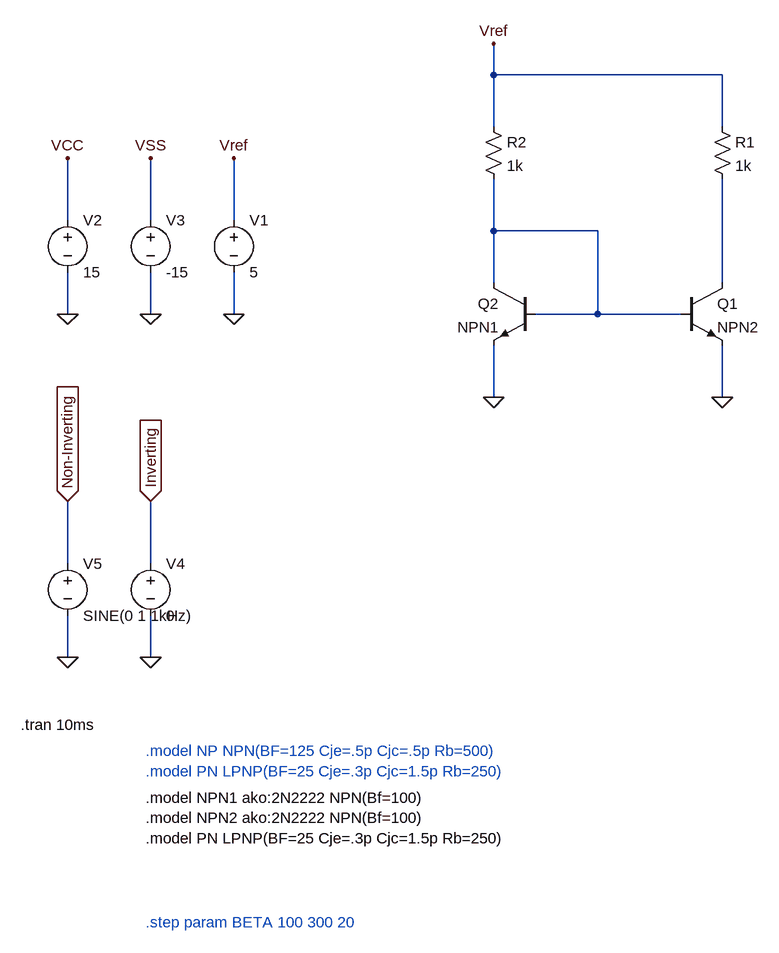
[diagram p0: schematic m_Opamp_VLSI_BJT_CST.asc]
m_Opamp_VLSI_BJT_CST.asc, the LTspice schematic file:
Version 4
SHEET 1 880 888
WIRE -1744 -432 -1744 -480
WIRE -1392 -432 -1744 -432
WIRE -1744 -352 -1744 -432
WIRE -1392 -352 -1392 -432
WIRE -2400 -208 -2400 -304
WIRE -2272 -208 -2272 -304
WIRE -2144 -208 -2144 -304
WIRE -1744 -192 -1744 -272
WIRE -1584 -192 -1744 -192
WIRE -1744 -112 -1744 -192
WIRE -1392 -112 -1392 -272
WIRE -2400 -64 -2400 -128
WIRE -2272 -64 -2272 -128
WIRE -2144 -64 -2144 -128
WIRE -1584 -64 -1584 -192
WIRE -1584 -64 -1680 -64
WIRE -1456 -64 -1584 -64
WIRE -1744 64 -1744 -16
WIRE -1392 64 -1392 -16
WIRE -2400 320 -2400 224
WIRE -2272 320 -2272 224
WIRE -2400 464 -2400 400
WIRE -2272 464 -2272 400
FLAG -2144 -64 0
FLAG -2144 -304 Vref
FLAG -2272 -64 0
FLAG -2400 -64 0
FLAG -2400 -304 VCC
FLAG -2272 -304 VSS
FLAG -2272 464 0
FLAG -2400 464 0
FLAG -2400 224 Non-Inverting
IOPIN -2400 224 In
FLAG -2272 224 Inverting
IOPIN -2272 224 In
FLAG -1744 64 0
FLAG -1392 64 0
FLAG -1744 -480 Vref
SYMBOL voltage -2144 -224 R0
SYMATTR InstName V1
SYMATTR Value 5
SYMBOL voltage -2400 -224 R0
SYMATTR InstName V2
SYMATTR Value 15
SYMBOL voltage -2272 -224 R0
WINDOW 123 0 0 Left 0
WINDOW 39 0 0 Left 0
SYMATTR InstName V3
SYMATTR Value -15
SYMBOL voltage -2272 304 R0
SYMATTR InstName V4
SYMATTR Value 0
SYMBOL voltage -2400 304 R0
WINDOW 123 0 0 Left 0
WINDOW 39 0 0 Left 0
SYMATTR InstName V5
SYMATTR Value SINE(0 1 1kHz)
SYMBOL npn -1456 -112 R0
SYMATTR InstName Q1
SYMATTR Value NPN2
SYMBOL npn -1680 -112 M0
SYMATTR InstName Q2
SYMATTR Value NPN1
SYMBOL res -1408 -368 R0
SYMATTR InstName R1
SYMATTR Value 1k
SYMBOL res -1760 -368 R0
SYMATTR InstName R2
SYMATTR Value 1k
TEXT -2280 680 Left 2 !.model NPN1 ako:2N2222 NPN(Bf=100)\n.model NPN2 ako:2N2222 NPN(Bf=100)\n.model PN LPNP(BF=25 Cje=.3p Cjc=1.5p Rb=250)
TEXT -2472 568 Left 2 !.tran 10ms
TEXT -2280 608 Left 2 ;.model NP NPN(BF=125 Cje=.5p Cjc=.5p Rb=500)\n.model PN LPNP(BF=25 Cje=.3p Cjc=1.5p Rb=250)
TEXT -2280 872 Left 2 ;.step param BETA 100 300 20

The netlist it stands for:
* m_Opamp_VLSI_BJT_CST.asc
V1 Vref 0 5
V2 VCC 0 15
V3 VSS 0 -15
V4 Inverting 0 0
V5 Non-Inverting 0 SINE(0 1 1kHz)
Q1 N002 N001 0 0 NPN2
Q2 N001 N001 0 0 NPN1
R1 Vref N002 1k
R2 Vref N001 1k
.model NPN NPN
.model PNP PNP
.lib standard.bjt
.model NPN1 ako:2N2222 NPN(Bf=100)
.model NPN2 ako:2N2222 NPN(Bf=100)
.model PN LPNP(BF=25 Cje=.3p Cjc=1.5p Rb=250)
.tran 10ms
* .model NP NPN(BF=125 Cje=.5p Cjc=.5p Rb=500)
* .model PN LPNP(BF=25 Cje=.3p Cjc=1.5p Rb=250)
* .step param BETA 100 300 20
.backanno
.end